# EAGLE schematic pchubMech (EAGLE 9.5.0)
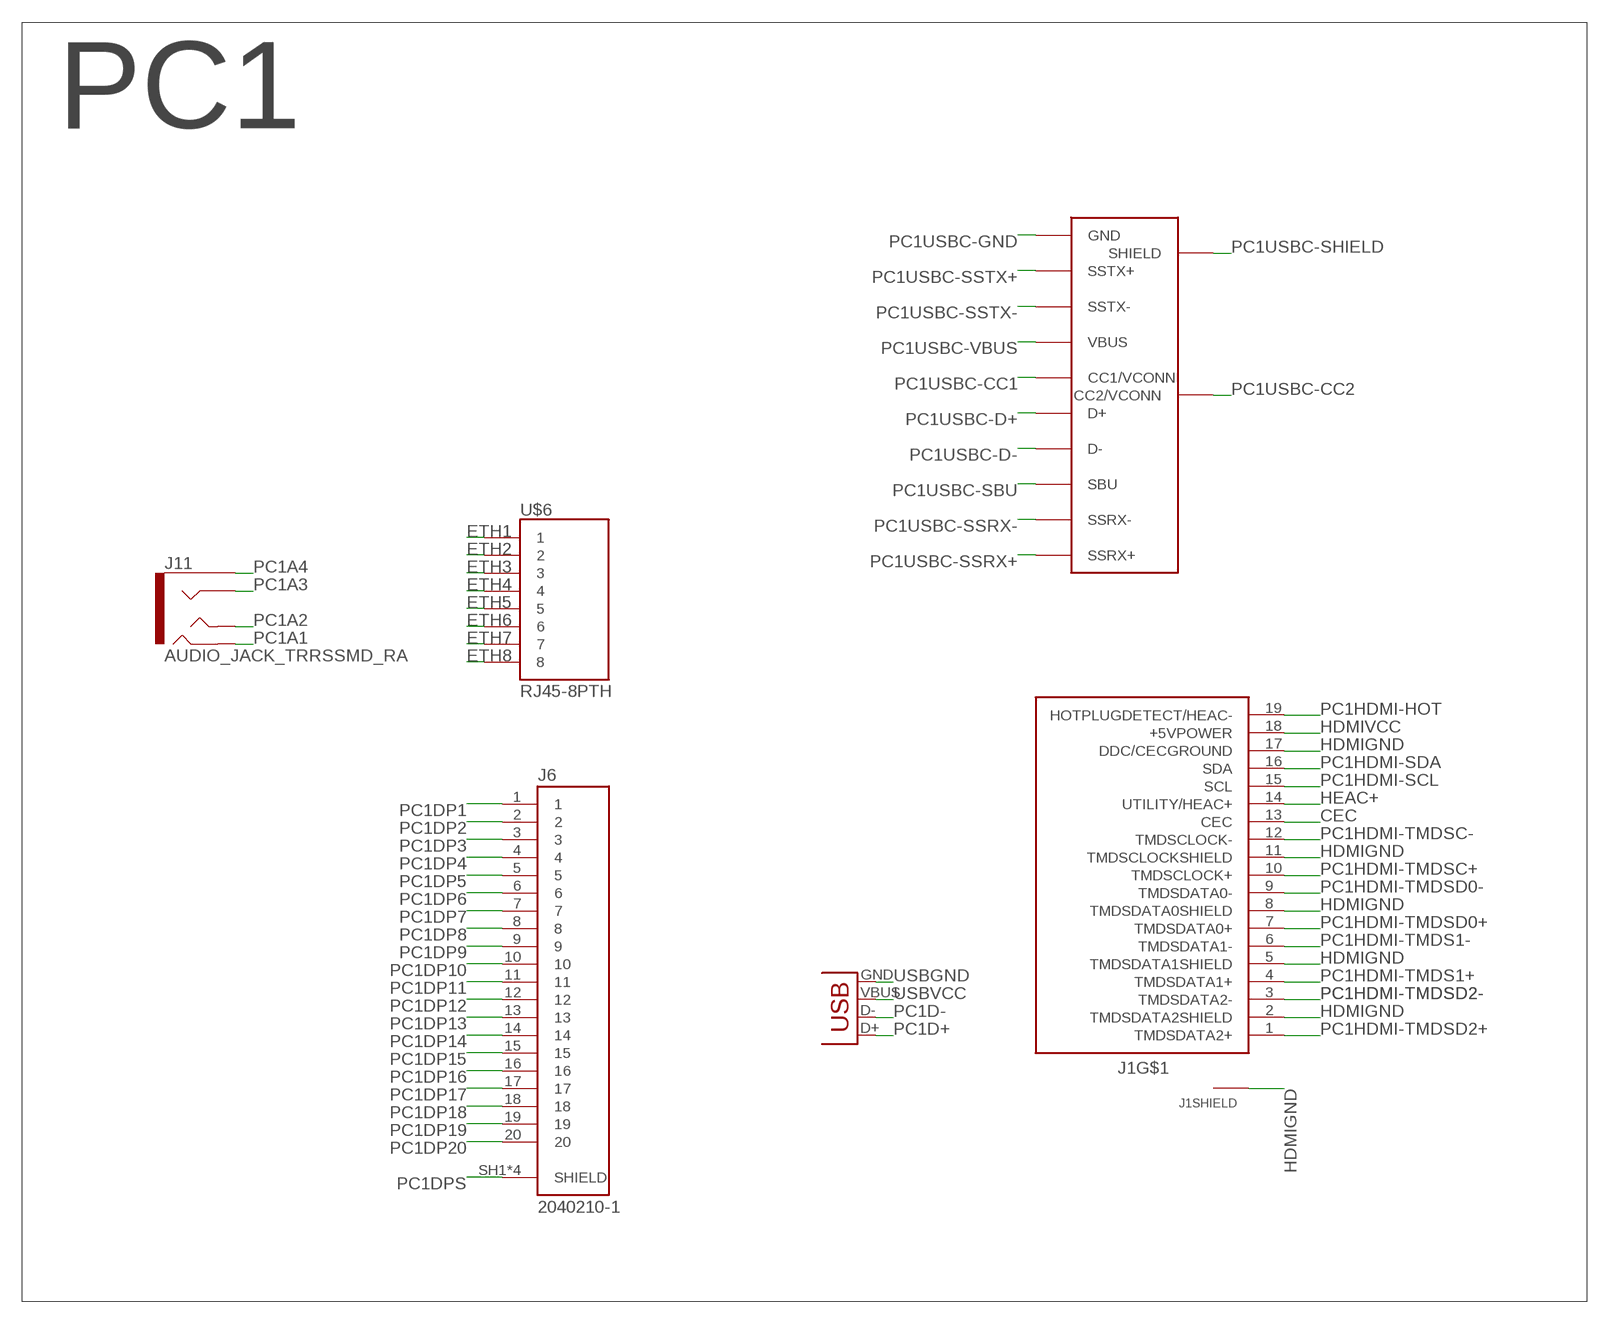
[diagram p0: schematic, sheet 1, part 1 of 3]
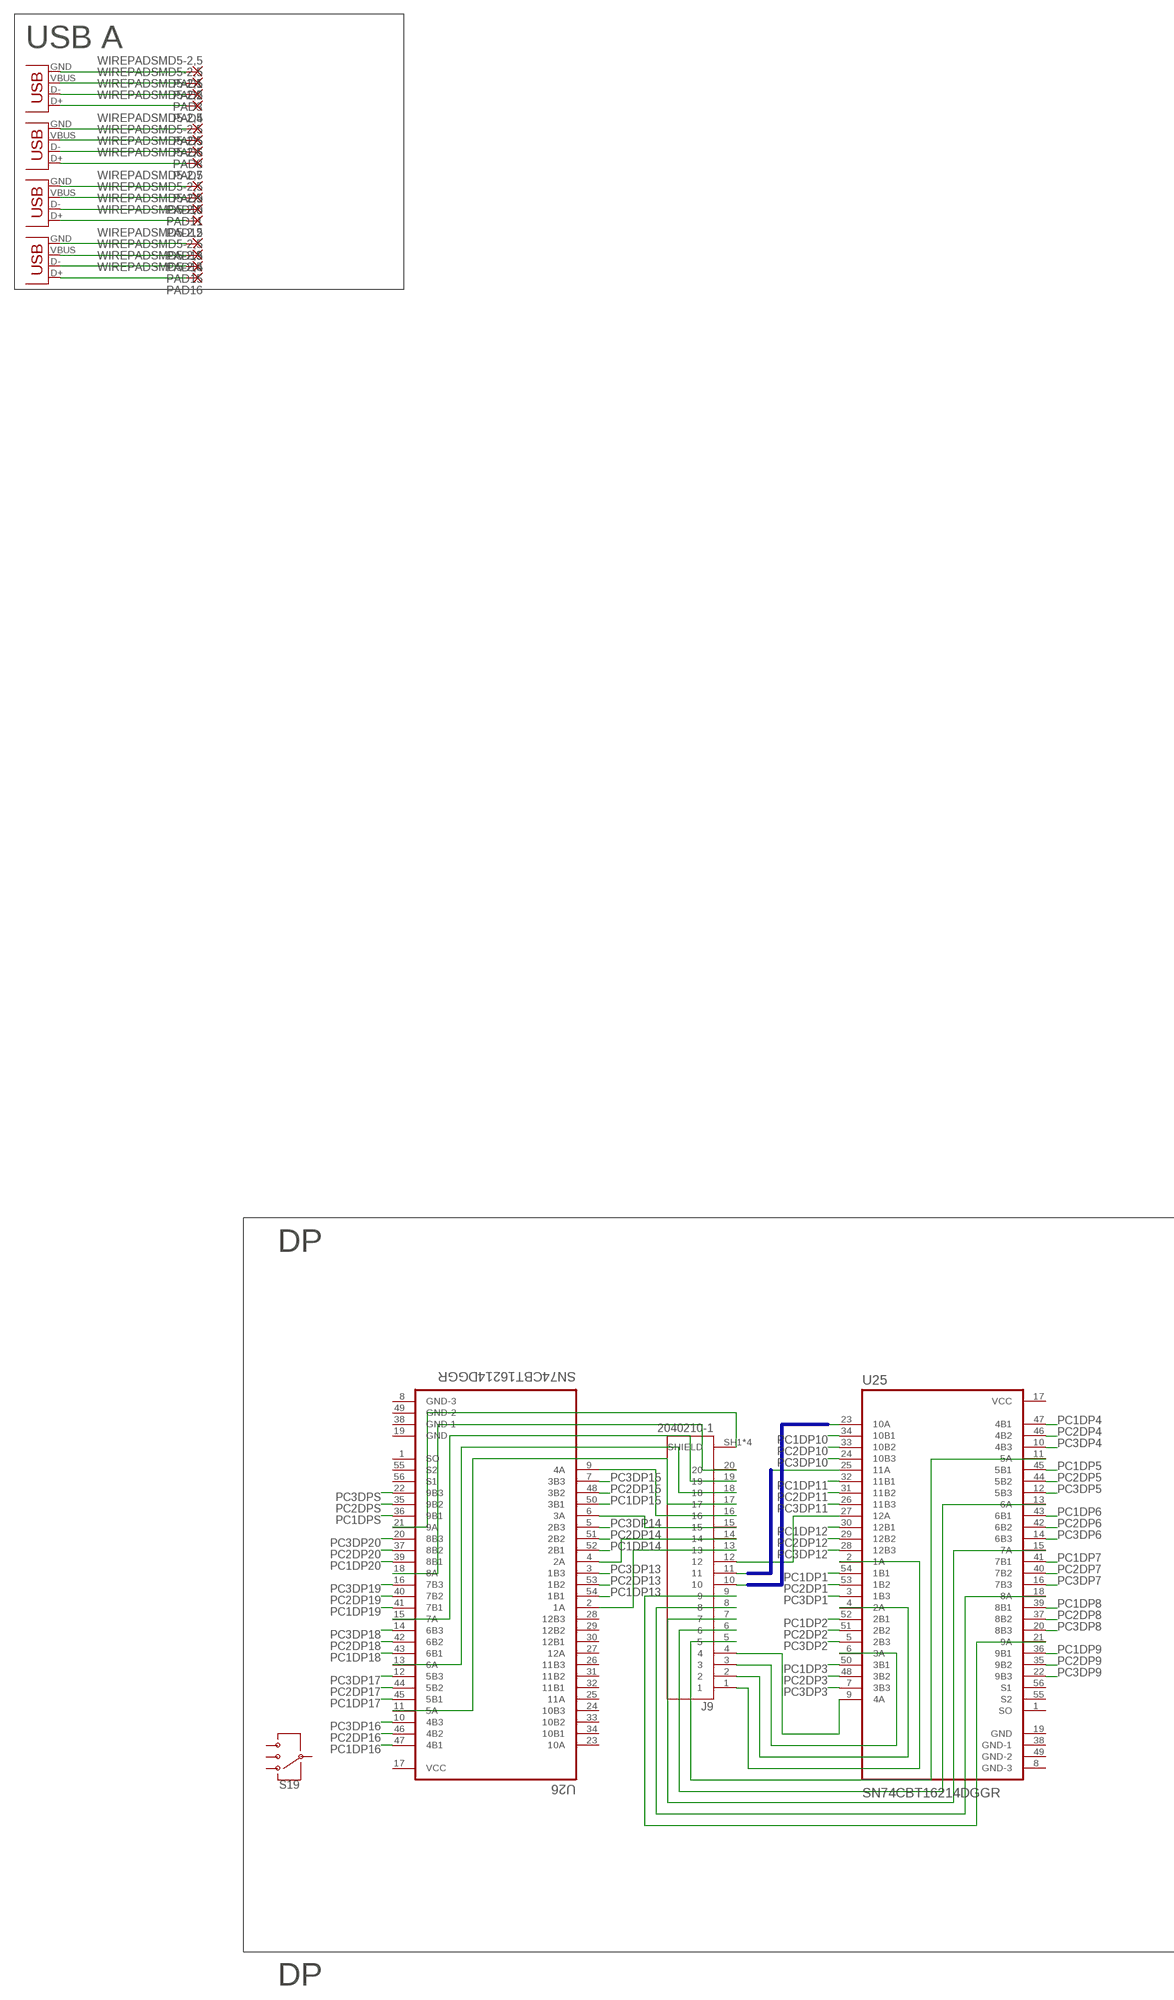
[diagram p1: schematic, sheet 1, part 2 of 3]
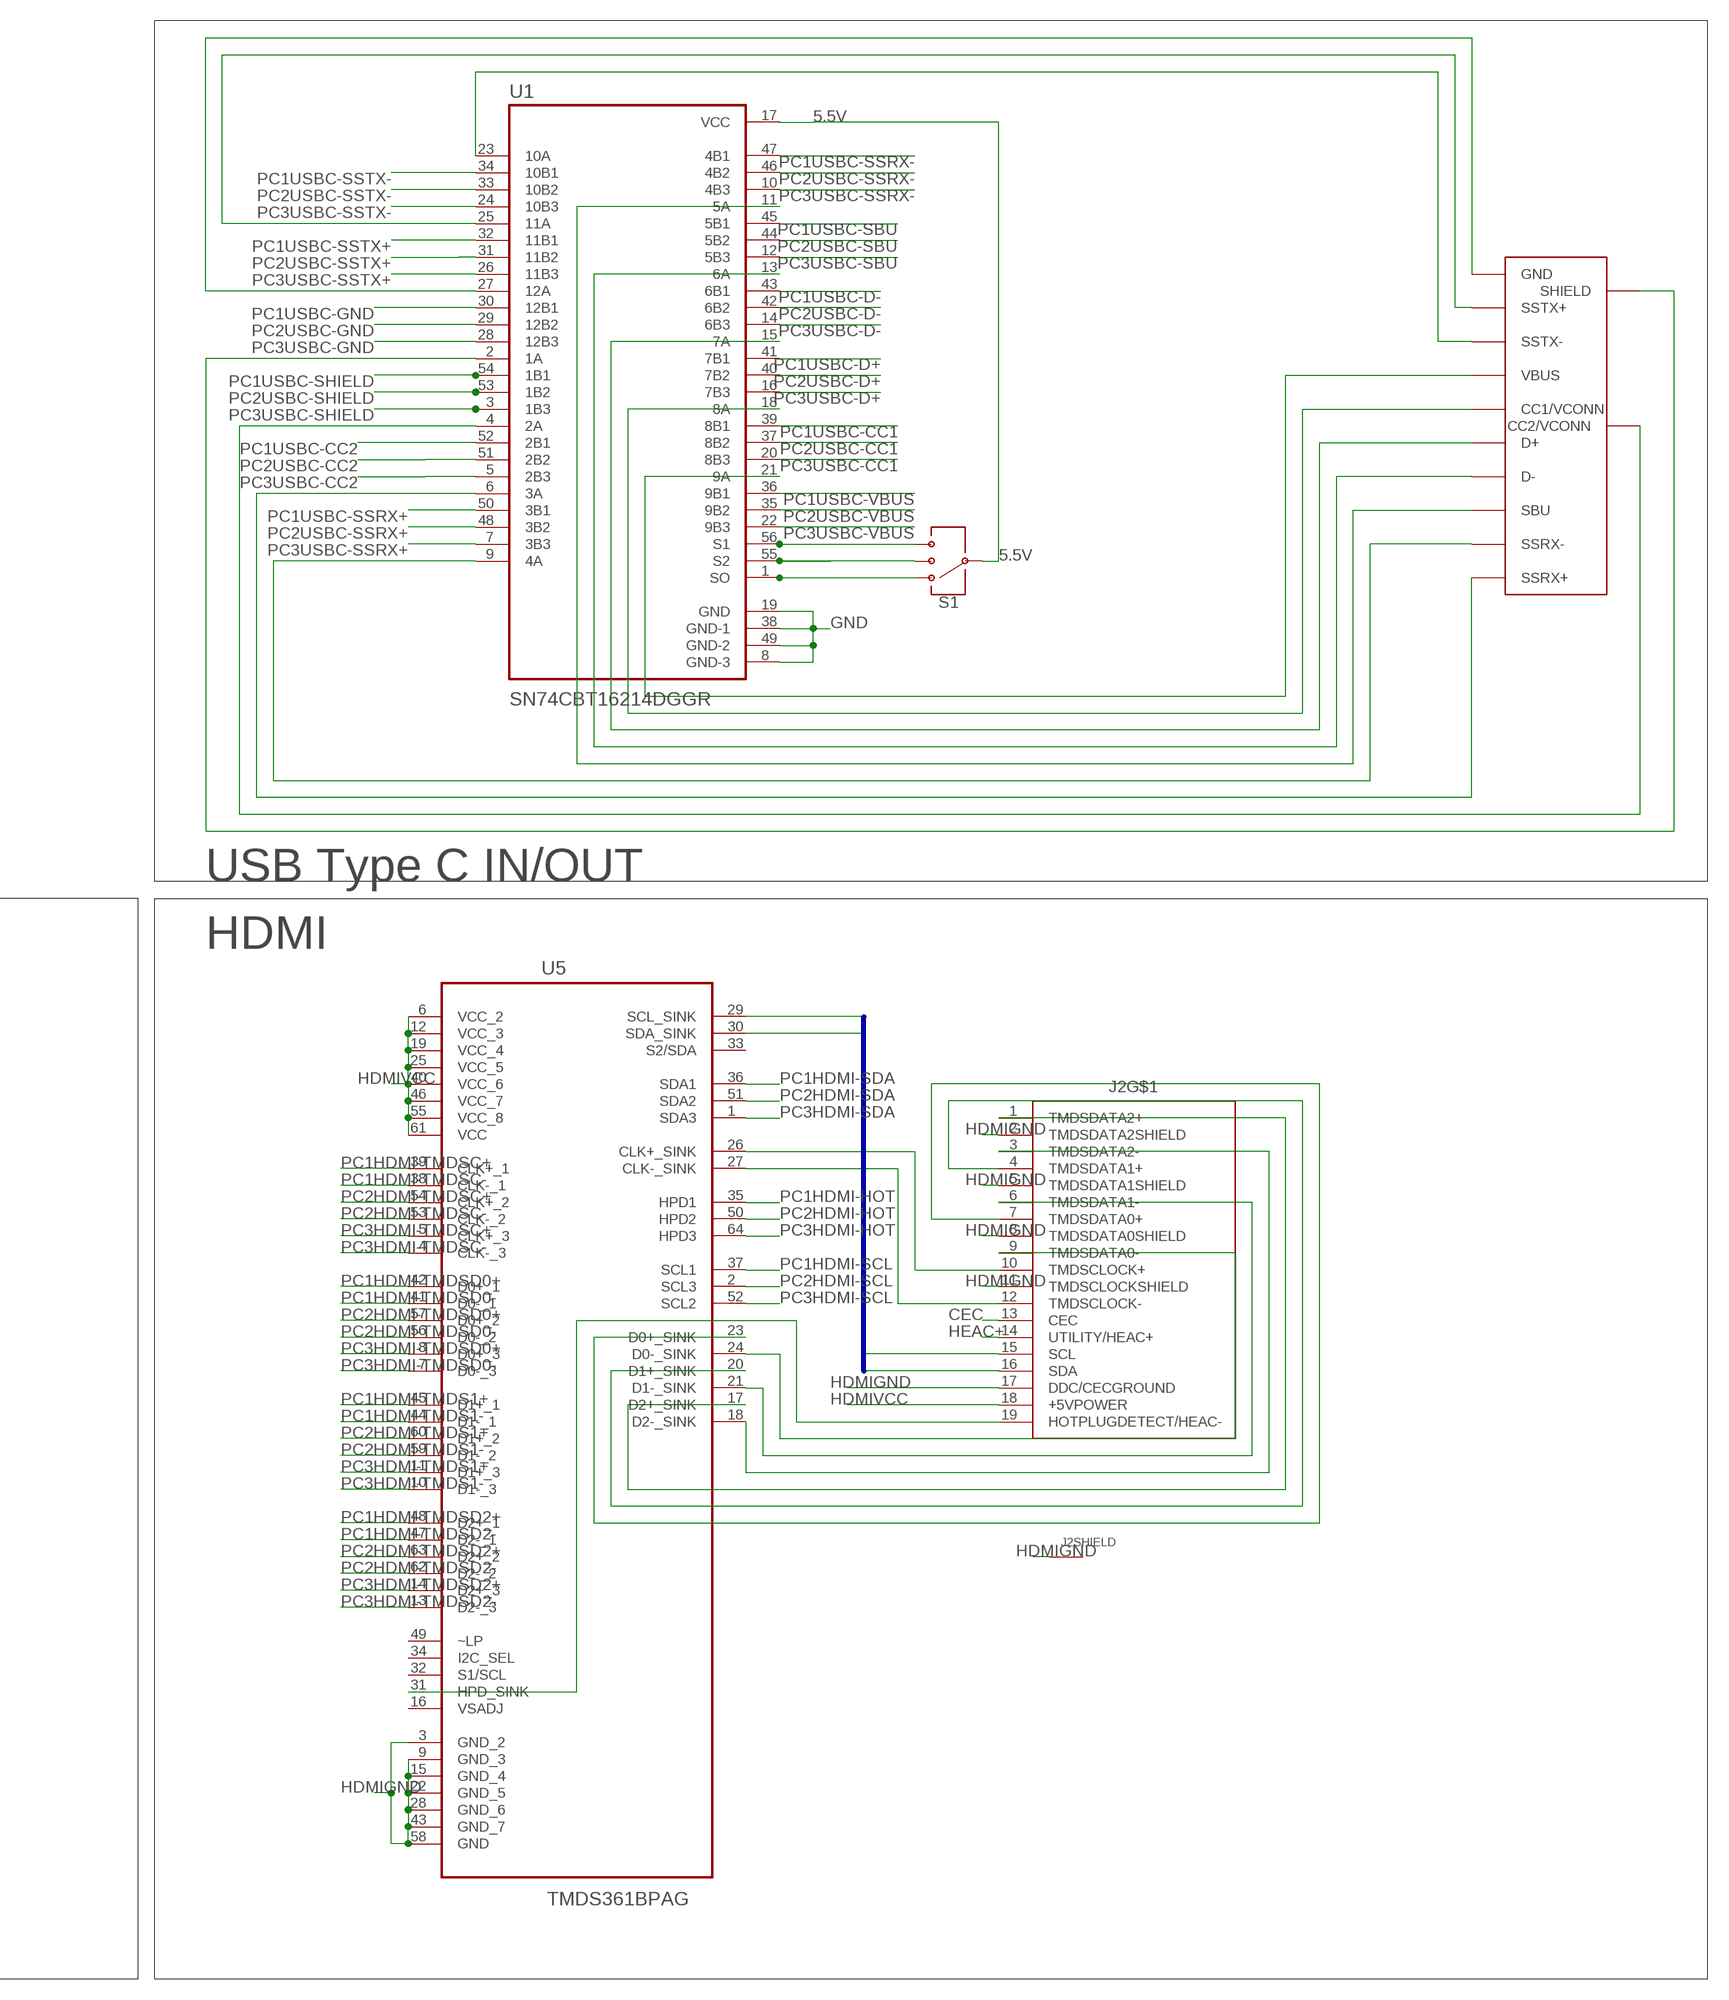
[diagram p2: schematic, sheet 1, part 3 of 3]

## Parts
J1  685119134923  [685119134923]
J2  685119134923  [685119134923]
J6  2040210-1  [TE_2040210-1]
J9  2040210-1  [TE_2040210-1]
J11  AUDIO_JACK_TRRSSMD_RA  [AUDIO_JACK_3.5MM_TRRS_SMD_RA]
PAD1  WIREPADSMD5-2,5  [5-2,5]
PAD2  WIREPADSMD5-2,5  [5-2,5]
PAD3  WIREPADSMD5-2,5  [5-2,5]
PAD4  WIREPADSMD5-2,5  [5-2,5]
PAD5  WIREPADSMD5-2,5  [5-2,5]
PAD6  WIREPADSMD5-2,5  [5-2,5]
PAD7  WIREPADSMD5-2,5  [5-2,5]
PAD8  WIREPADSMD5-2,5  [5-2,5]
PAD9  WIREPADSMD5-2,5  [5-2,5]
PAD10  WIREPADSMD5-2,5  [5-2,5]
PAD11  WIREPADSMD5-2,5  [5-2,5]
PAD12  WIREPADSMD5-2,5  [5-2,5]
PAD13  WIREPADSMD5-2,5  [5-2,5]
PAD14  WIREPADSMD5-2,5  [5-2,5]
PAD15  WIREPADSMD5-2,5  [5-2,5]
PAD16  WIREPADSMD5-2,5  [5-2,5]
S1  SWITCH-SP3T-SMD  [SWITCH_SP3T_SMD]
S19  SWITCH-SP3T-SMD  [SWITCH_SP3T_SMD]
U1  SN74CBT16214DGGR  [SOP50P810X120-56N]
U5  TMDS361BPAG  [QFP50P1200X1200X120-64N]
U25  SN74CBT16214DGGR  [SOP50P810X120-56N]
U26  SN74CBT16214DGGR  [SOP50P810X120-56N]
U$1  USB-TYPE-C  [USB-TYPE-C-SMT]
U$3  USB-TYPE-C  [USB-TYPE-C-SMT]
U$6  RJ45-8PTH  [RJ45-8]
X1  USB  [USB-A-S-NOSILK-FEMALE]
X2  USB  [USB-A-S-NOSILK-FEMALE]
X3  USB  [USB-A-S-NOSILK-FEMALE]
X4  USB  [USB-A-S-NOSILK-FEMALE]
X10  USB  [USB-A-S-NOSILK-FEMALE]

## Nets
5.5V: S1.3 U1.17(VCC)
B$1: U25.23(10A)
B$2: U25.25(11A)
CEC: J1.13(CEC) J2.13(CEC)
ETH1: U$6.1
ETH2: U$6.2
ETH3: U$6.3
ETH4: U$6.4
ETH5: U$6.5
ETH6: U$6.6
ETH7: U$6.7
ETH8: U$6.8
GND: U1.8(GND-3) U1.19(GND) U1.38(GND-1) U1.49(GND-2)
HDMIGND: J1.2(TMDSDATA2SHIELD) J1.5(TMDSDATA1SHIELD) J1.8(TMDSDATA0SHIELD) J1.11(TMDSCLOCKSHIELD) J1.17(DDC/CECGROUND) J1.SHELL1(SHIELD:SHIELD) J1.SHELL2(SHIELD:SHIELD) J1.SHELL3(SHIELD:SHIELD) J1.SHELL(SHIELD:SHIELD) J2.2(TMDSDATA2SHIELD) J2.5(TMDSDATA1SHIELD) J2.8(TMDSDATA0SHIELD) J2.11(TMDSCLOCKSHIELD) J2.17(DDC/CECGROUND) J2.SHELL1(SHIELD:SHIELD) J2.SHELL2(SHIELD:SHIELD) J2.SHELL3(SHIELD:SHIELD) J2.SHELL(SHIELD:SHIELD) U5.3(GND_2) U5.9(GND_3) U5.15(GND_4) U5.22(GND_5) U5.28(GND_6) U5.43(GND_7) U5.58(GND)
HDMIVCC: J1.18(+5VPOWER) J2.18(+5VPOWER) U5.6(VCC_2) U5.12(VCC_3) U5.19(VCC_4) U5.25(VCC_5) U5.40(VCC_6) U5.46(VCC_7) U5.55(VCC_8) U5.61(VCC)
HEAC+: J1.14(UTILITY/HEAC+) J2.14(UTILITY/HEAC+)
N$1: PAD1.1(P) X10.GND
N$2: PAD2.1(P) X10.VBUS
N$3: PAD3.1(P) X10.D-
N$4: PAD4.1(P) X10.D+
N$5: PAD5.1(P) X1.GND
N$6: PAD6.1(P) X1.VBUS
N$7: PAD8.1(P) X1.D-
N$8: PAD7.1(P) X1.D+
N$9: PAD9.1(P) X3.GND
N$10: PAD10.1(P) X3.VBUS
N$11: PAD11.1(P) X3.D-
N$12: PAD12.1(P) X3.D+
N$13: PAD16.1(P) X4.D+
N$14: PAD15.1(P) X4.D-
N$15: PAD14.1(P) X4.VBUS
N$16: PAD13.1(P) X4.GND
N$35: S1.4 U1.56(S1)
N$36: S1.2 U1.55(S2)
N$37: S1.1 U1.1(SO)
N$46: J2.3(TMDSDATA2-) U5.18(D2-_SINK)
N$47: J2.1(TMDSDATA2+) U5.17(D2+_SINK)
N$48: J2.6(TMDSDATA1-) U5.21(D1-_SINK)
N$49: J2.4(TMDSDATA1+) U5.20(D1+_SINK)
N$50: J2.9(TMDSDATA0-) U5.24(D0-_SINK)
N$51: J2.7(TMDSDATA0+) U5.23(D0+_SINK)
N$52: J2.12(TMDSCLOCK-) U5.27(CLK-_SINK)
N$53: J2.10(TMDSCLOCK+) U5.26(CLK+_SINK)
N$54: J2.19(HOTPLUGDETECT/HEAC-) U5.31(HPD_SINK)
N$132: U1.18(8A) U$3.5(CC1/VCONN)
N$133: U1.23(10A) U$3.3(SSTX-) U$3.B3(SSTX-)
N$134: U1.25(11A) U$3.2(SSTX+) U$3.B2(SSTX+)
N$135: U1.27(12A) U$3.1(GND) U$3.12(GND) U$3.B1(GND) U$3.B12(GND)
N$136: U1.2(1A) U$3.P$1(SHIELD) U$3.P$2(SHIELD) U$3.P$3(SHIELD) U$3.P$4(SHIELD) U$3.P$5(SHIELD) U$3.P$6(SHIELD) U$3.P$7(SHIELD) U$3.P$8(SHIELD) U$3.P$9(SHIELD) U$3.P$10(SHIELD) U$3.P$11(SHIELD) U$3.P$12(SHIELD) U$3.P$13(SHIELD) U$3.P$14(SHIELD) U$3.P$15(SHIELD) U$3.P$16(SHIELD) U$3.P$17(SHIELD) U$3.P$18(SHIELD) U$3.P$19(SHIELD) U$3.P$20(SHIELD) U$3.P$21(SHIELD) U$3.P$22(SHIELD) U$3.P$23(SHIELD) U$3.P$24(SHIELD) U$3.P$25(SHIELD) U$3.P$26(SHIELD) U$3.P$27(SHIELD) U$3.P$28(SHIELD)
N$137: U1.4(2A) U$3.B5(CC2/VCONN)
N$138: U1.15(7A) U$3.6(D+) U$3.B6(D+)
N$139: U1.13(6A) U$3.7(D-) U$3.B7(D-)
N$140: U1.11(5A) U$3.8(SBU) U$3.B8(SBU)
N$141: U1.9(4A) U$3.10(SSRX-) U$3.B10(SSRX-)
N$142: U1.6(3A) U$3.11(SSRX+) U$3.B11(SSRX+)
N$183: J9.1 U25.2(1A)
N$184: J9.2 U25.4(2A)
N$185: J9.3 U25.6(3A)
N$186: J9.4 U25.9(4A)
N$187: J9.5 U25.11(5A)
N$188: J9.6 U25.13(6A)
N$189: J9.7 U25.15(7A)
N$190: J9.8 U25.18(8A)
N$191: J9.9 U25.21(9A)
N$192: J9.10
N$193: J9.11
N$194: J9.12 U25.27(12A)
N$195: J9.13 U26.2(1A)
N$196: J9.14 U26.4(2A)
N$197: J9.15 U26.6(3A)
N$198: J9.16 U26.9(4A)
N$199: J9.17 U26.11(5A)
N$200: J9.18 U26.13(6A)
N$201: J9.19 U26.15(7A)
N$202: J9.SH1(SHIELD) J9.SH2(SHIELD) J9.SH3(SHIELD) J9.SH4(SHIELD) U26.21(9A)
N$203: J9.20 U26.18(8A)
PC1A1: J11.RING2
PC1A2: J11.TIP
PC1A3: J11.RING1
PC1A4: J11.EARTH
PC1D+: X2.D+
PC1D-: X2.D-
PC1DP1: J6.1 U25.54(1B1)
PC1DP2: J6.2 U25.52(2B1)
PC1DP3: J6.3 U25.50(3B1)
PC1DP4: J6.4 U25.47(4B1)
PC1DP5: J6.5 U25.45(5B1)
PC1DP6: J6.6 U25.43(6B1)
PC1DP7: J6.7 U25.41(7B1)
PC1DP8: J6.8 U25.39(8B1)
PC1DP9: J6.9 U25.36(9B1)
PC1DP10: J6.10 U25.34(10B1)
PC1DP11: J6.11 U25.32(11B1)
PC1DP12: J6.12 U25.30(12B1)
PC1DP13: J6.13 U26.54(1B1)
PC1DP14: J6.14 U26.52(2B1)
PC1DP15: J6.15 U26.50(3B1)
PC1DP16: J6.16 U26.47(4B1)
PC1DP17: J6.17 U26.45(5B1)
PC1DP18: J6.18 U26.43(6B1)
PC1DP19: J6.19 U26.41(7B1)
PC1DP20: J6.20 U26.39(8B1)
PC1DPS: J6.SH1(SHIELD) J6.SH2(SHIELD) J6.SH3(SHIELD) J6.SH4(SHIELD) U26.36(9B1)
PC1HDMI-HOT: J1.19(HOTPLUGDETECT/HEAC-) U5.35(HPD1)
PC1HDMI-SCL: J1.15(SCL) U5.37(SCL1)
PC1HDMI-SDA: J1.16(SDA) U5.36(SDA1)
PC1HDMI-TMDS1+: J1.4(TMDSDATA1+) U5.45(D1+_1)
PC1HDMI-TMDS1-: J1.6(TMDSDATA1-) U5.44(D1-_1)
PC1HDMI-TMDSC+: J1.10(TMDSCLOCK+) U5.39(CLK+_1)
PC1HDMI-TMDSC-: J1.12(TMDSCLOCK-) U5.38(CLK-_1)
PC1HDMI-TMDSD0+: J1.7(TMDSDATA0+) U5.42(D0+_1)
PC1HDMI-TMDSD0-: J1.9(TMDSDATA0-) U5.41(D0-_1)
PC1HDMI-TMDSD2+: J1.1(TMDSDATA2+) U5.48(D2+_1)
PC1HDMI-TMDSD2-: J1.3(TMDSDATA2-) U5.47(D2-_1)
PC1USBC-CC1: U1.39(8B1) U$1.5(CC1/VCONN)
PC1USBC-CC2: U1.52(2B1) U$1.B5(CC2/VCONN)
PC1USBC-D+: U1.41(7B1) U$1.6(D+) U$1.B6(D+)
PC1USBC-D-: U1.43(6B1) U$1.7(D-) U$1.B7(D-)
PC1USBC-GND: U1.30(12B1) U$1.1(GND) U$1.12(GND) U$1.B1(GND) U$1.B12(GND)
PC1USBC-SBU: U1.45(5B1) U$1.8(SBU) U$1.B8(SBU)
PC1USBC-SHIELD: U1.54(1B1) U$1.P$1(SHIELD) U$1.P$2(SHIELD) U$1.P$3(SHIELD) U$1.P$4(SHIELD) U$1.P$5(SHIELD) U$1.P$6(SHIELD) U$1.P$7(SHIELD) U$1.P$8(SHIELD) U$1.P$9(SHIELD) U$1.P$10(SHIELD) U$1.P$11(SHIELD) U$1.P$12(SHIELD) U$1.P$13(SHIELD) U$1.P$14(SHIELD) U$1.P$15(SHIELD) U$1.P$16(SHIELD) U$1.P$17(SHIELD) U$1.P$18(SHIELD) U$1.P$19(SHIELD) U$1.P$20(SHIELD) U$1.P$21(SHIELD) U$1.P$22(SHIELD) U$1.P$23(SHIELD) U$1.P$24(SHIELD) U$1.P$25(SHIELD) U$1.P$26(SHIELD) U$1.P$27(SHIELD) U$1.P$28(SHIELD)
PC1USBC-SSRX+: U1.50(3B1) U$1.11(SSRX+) U$1.B11(SSRX+)
PC1USBC-SSRX-: U1.47(4B1) U$1.10(SSRX-) U$1.B10(SSRX-)
PC1USBC-SSTX+: U1.32(11B1) U$1.2(SSTX+) U$1.B2(SSTX+)
PC1USBC-SSTX-: U1.34(10B1) U$1.3(SSTX-) U$1.B3(SSTX-)
PC1USBC-VBUS: U1.36(9B1) U$1.4(VBUS) U$1.9(VBUS) U$1.B4(VBUS) U$1.B9(VBUS)
PC2DP1: U25.53(1B2)
PC2DP2: U25.51(2B2)
PC2DP3: U25.48(3B2)
PC2DP4: U25.46(4B2)
PC2DP5: U25.44(5B2)
PC2DP6: U25.42(6B2)
PC2DP7: U25.40(7B2)
PC2DP8: U25.37(8B2)
PC2DP9: U25.35(9B2)
PC2DP10: U25.33(10B2)
PC2DP11: U25.31(11B2)
PC2DP12: U25.29(12B2)
PC2DP13: U26.53(1B2)
PC2DP14: U26.51(2B2)
PC2DP15: U26.48(3B2)
PC2DP16: U26.46(4B2)
PC2DP17: U26.44(5B2)
PC2DP18: U26.42(6B2)
PC2DP19: U26.40(7B2)
PC2DP20: U26.37(8B2)
PC2DPS: U26.35(9B2)
PC2HDMI-HOT: U5.50(HPD2)
PC2HDMI-SCL: U5.2(SCL3)
PC2HDMI-SDA: U5.51(SDA2)
PC2HDMI-TMDS1+: U5.60(D1+_2)
PC2HDMI-TMDS1-: U5.59(D1-_2)
PC2HDMI-TMDSC+: U5.54(CLK+_2)
PC2HDMI-TMDSC-: U5.53(CLK-_2)
PC2HDMI-TMDSD0+: U5.57(D0+_2)
PC2HDMI-TMDSD0-: U5.56(D0-_2)
PC2HDMI-TMDSD2+: U5.63(D2+_2)
PC2HDMI-TMDSD2-: U5.62(D2-_2)
PC2USBC-CC1: U1.37(8B2)
PC2USBC-CC2: U1.51(2B2)
PC2USBC-D+: U1.40(7B2)
PC2USBC-D-: U1.42(6B2)
PC2USBC-GND: U1.29(12B2)
PC2USBC-SBU: U1.44(5B2)
PC2USBC-SHIELD: U1.53(1B2)
PC2USBC-SSRX+: U1.48(3B2)
PC2USBC-SSRX-: U1.46(4B2)
PC2USBC-SSTX+: U1.31(11B2)
PC2USBC-SSTX-: U1.33(10B2)
PC2USBC-VBUS: U1.35(9B2)
PC3DP1: U25.3(1B3)
PC3DP2: U25.5(2B3)
PC3DP3: U25.7(3B3)
PC3DP4: U25.10(4B3)
PC3DP5: U25.12(5B3)
PC3DP6: U25.14(6B3)
PC3DP7: U25.16(7B3)
PC3DP8: U25.20(8B3)
PC3DP9: U25.22(9B3)
PC3DP10: U25.24(10B3)
PC3DP11: U25.26(11B3)
PC3DP12: U25.28(12B3)
PC3DP13: U26.3(1B3)
PC3DP14: U26.5(2B3)
PC3DP15: U26.7(3B3)
PC3DP16: U26.10(4B3)
PC3DP17: U26.12(5B3)
PC3DP18: U26.14(6B3)
PC3DP19: U26.16(7B3)
PC3DP20: U26.20(8B3)
PC3DPS: U26.22(9B3)
PC3HDMI-HOT: U5.64(HPD3)
PC3HDMI-SCL: U5.52(SCL2)
PC3HDMI-SDA: U5.1(SDA3)
PC3HDMI-TMDS1+: U5.11(D1+_3)
PC3HDMI-TMDS1-: U5.10(D1-_3)
PC3HDMI-TMDSC+: U5.5(CLK+_3)
PC3HDMI-TMDSC-: U5.4(CLK-_3)
PC3HDMI-TMDSD0+: U5.8(D0+_3)
PC3HDMI-TMDSD0-: U5.7(D0-_3)
PC3HDMI-TMDSD2+: U5.14(D2+_3)
PC3HDMI-TMDSD2-: U5.13(D2-_3)
PC3USBC-CC1: U1.20(8B3)
PC3USBC-CC2: U1.5(2B3)
PC3USBC-D+: U1.16(7B3)
PC3USBC-D-: U1.14(6B3)
PC3USBC-GND: U1.28(12B3)
PC3USBC-SBU: U1.12(5B3)
PC3USBC-SHIELD: U1.3(1B3)
PC3USBC-SSRX+: U1.7(3B3)
PC3USBC-SSRX-: U1.10(4B3)
PC3USBC-SSTX+: U1.26(11B3)
PC3USBC-SSTX-: U1.24(10B3)
PC3USBC-VBUS: U1.22(9B3)
SCL: J2.15(SCL) U5.29(SCL_SINK)
SDA: J2.16(SDA) U5.30(SDA_SINK)
USBGND: X2.GND
USBVCC: X2.VBUS
VBUS: U1.21(9A) U$3.4(VBUS) U$3.9(VBUS) U$3.B4(VBUS) U$3.B9(VBUS)
Unconnected: S19.1 S19.2 S19.3 S19.4 U5.16(VSADJ) U5.32(S1/SCL) U5.33(S2/SDA) U5.34(I2C_SEL) U5.49(~LP) U25.1(SO) U25.55(S2) U25.56(S1) U26.1(SO) U26.23(10A) U26.24(10B3) U26.25(11A) U26.26(11B3) U26.27(12A) U26.28(12B3) U26.29(12B2) U26.30(12B1) U26.31(11B2) U26.32(11B1) U26.33(10B2) U26.34(10B1) U26.55(S2) U26.56(S1)

## Buses
I2C:SCL,SDA
B$1
B$2

## Notes on the sheet
- USB A
- PC1
- USB Type C IN/OUT
- DP | HDMI
- DP

## Power pins joined to a net without a drawn wire
GND: U25.19(GND) U26.19(GND)
GND-1: U25.38(GND-1) U26.38(GND-1)
GND-2: U25.49(GND-2) U26.49(GND-2)
GND-3: U25.8(GND-3) U26.8(GND-3)
VCC: U25.17(VCC) U26.17(VCC)

## Library data of the parts
J1 J2 = Wurth_Elektronik_Electromechanic_Input-Output_Connectors_rev17b:685119134923: WR-COM SMT Horizontal HDMI, 19 pins=>Code : Con_I-O_COM_HDMI_685119134923 <http://katalog.we-online.de/media/images/eican/Con_I-O_COM_HDMI_685119134923_pf2.jpg> Details see: http://katalog.we-online.de/en/em/COM_SMT_HORIZONTAL/685119134923 Created 2014-07-09, Karrer Zheng 2014 (C) Würth Elektronik
J6 J9 = 2040210-1:2040210-1: Conn Display Port RCP 20 POS 0.5mm Solder RA Thru-Hole 20 Terminal 1 Port Tray; AVAILABILITY: Good; DESCRIPTION: Conn Display Port RCP 20 POS 0.5mm Solder RA Thru-Hole 20 Terminal 1 Port Tray; MF: TE Connectivity; MP: 2040210-1; PACKAGE: None; PRICE: 1.36 USD
J11 = SparkFun-Connectors:AUDIO_JACK_TRRS: Audio Jack - 3.5mm TRRS (SMD) This is a 3.5mm TRRS SMD audio jack. TRRS connectors are the audio-style connectors that you see on some phones, MP3 players and development boards. TRRS stands for “tip, ring, ring, sleeve,” which reflects that this has three conductors and a ground. SparkFun Products: Audio Jack <https://www.sparkfun.com/products/12639> mbed Starter Kit <https://www.sparkfun.com/products/12968> SparkFun TRRS 3.5mm Jack Breakout <https://www.sparkfun.com/products/11570>; PROD_ID: CONN-10676; SF_ID: PRT-12639
PAD1-PAD16 = wirepad:WIREPAD: Wire PAD connect wire on PCB
S1 S19 = SparkFun-Switches:SWITCH-SP3T: Single-Pole, Triple-Throw (SP3T) Switch Single-Pole, Triple-Throw switches SparkFun Products Prototype Part; PROD_ID: SWCH-10805
U1 U25 U26 = SN74CBT16214DGGR:SN74CBT16214DGGR: None; AVAILABILITY: Good; DESCRIPTION: Multiplexer/Demultiplexer Bus Switch 1-Element CMOS 36-IN 56-Pin TSSOP T/R; MF: Texas Instruments; MP: SN74CBT16214DGGR; PACKAGE: TSSOP-56 Texas Instruments; PRICE: 1.31 USD
U5 = TMDS361BPAG:TMDS361BPAG: Three-Port HDMI Switch; AVAILABILITY: Good; DESCRIPTION: Ic Switch Dvi/Hdmi 3: 1 64-Tqfp - Tmds361bpag; MF: Texas Instruments; MP: TMDS361BPAG; PACKAGE: TQFP-64 Texas Instruments; PRICE: 3.46 USD
U$1 U$3 = lio:USB-TYPE-C
U$6 = SparkFun:RJ45-8: RJ45 Jack Simple RJ45, 8-pin connection - connector for common Cat5, Cat5e, and Cat6 Ethernet cables. Footprint not yet proven in production. Connector sku is PRT-00643; Breakout PCB sku is BOB-00716.
X1-X4 X10 = SparkFun:USB: USB Connectors USB-B-PTH is fully proven SKU : PRT-00139 USB-miniB is fully proven SKU : PRT-00587 USB-A-PCB is untested. USB-A-H is throughly reviewed, but untested. Spark Fun Electronics SKU : PRT-00437 USB-B-SMT is throughly reviewed, but untested. Needs silkscreen touching up. USB-A-S has not been used/tested USB-MB-H has not been used/tested